# EAGLE design MODULO_BUZZER (EAGLE 7.5.0)
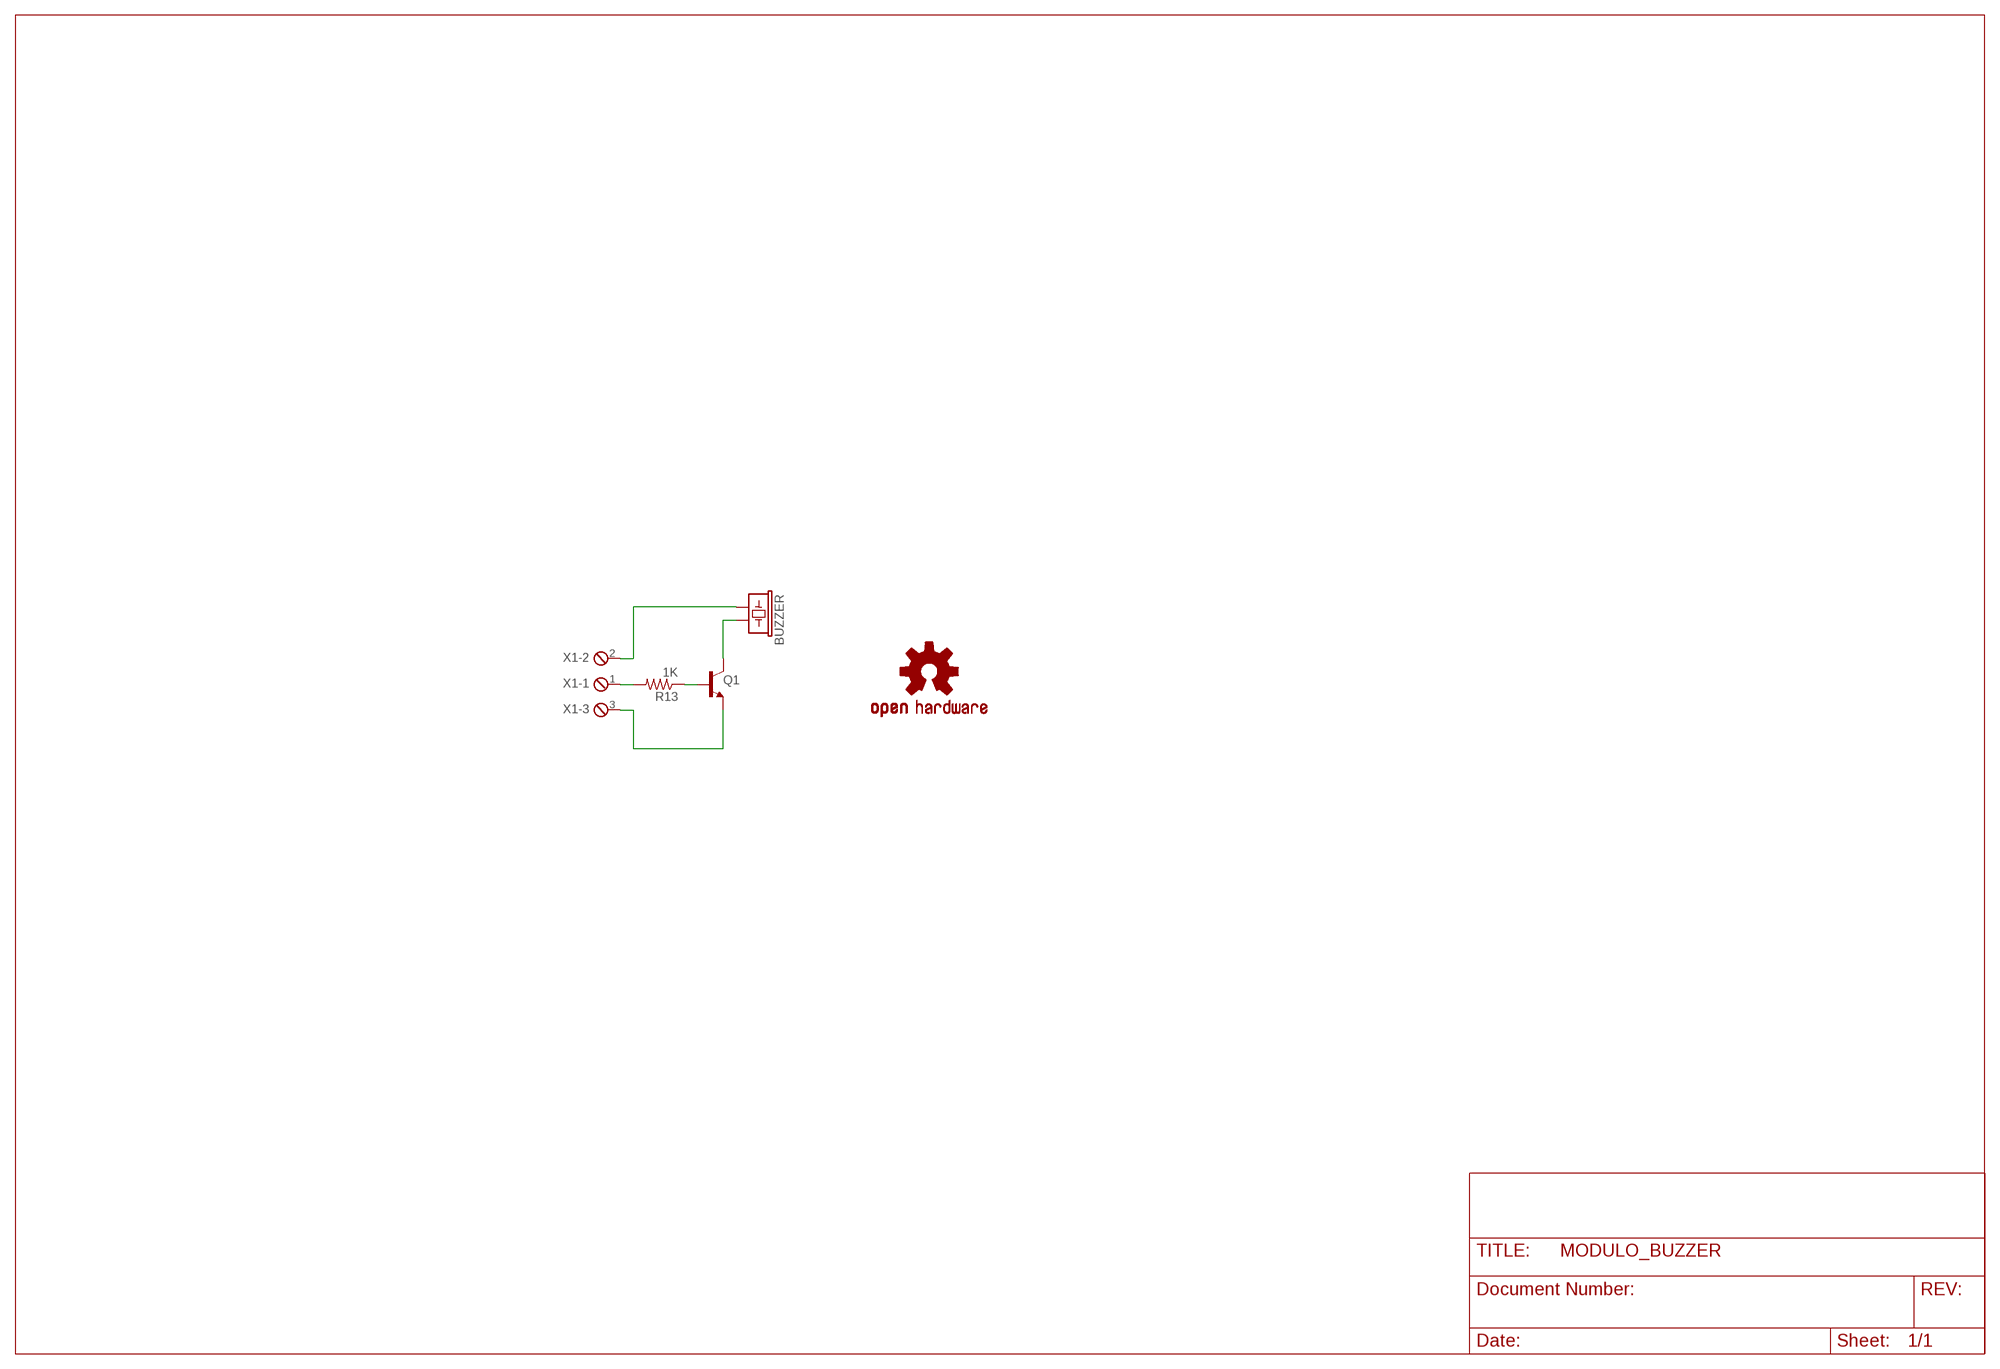
[diagram p0: schematic, sheet 1]

## Parts
BUZZER  BUZZERNS  [BUZZER-12MM-NS]
LOGO1  OSHW-LOGOM  [OSHW-LOGO-M]
Q1  BC548  [TO92-EBC]
R13  1K  RESISTORPTH-1/4W  [AXIAL-0.4]
X1  MPT3  [3POL254]

## Nets
N$27: Q1.B R13.P$1
N$28: BUZZER.+ X1.2
N$29: BUZZER.- Q1.C
N$30: Q1.E X1.3
N$32: R13.P$2 X1.1

## Library data of the parts
BUZZER = SparkFun:BUZZER: Buzzer 12mm Spark Fun Electronics SKU : Comp-Buzzer
LOGO1 = SparkFun-Aesthetics:OSHW-LOGO: Open Source Hardware Logo This logo indicates the piece of hardware it is found on incorporates a OSHW license and/or adheres to the definition of open source hardware found here: http://freedomdefined.org/OSHW
Q1 = transistor-npn:BC548*: NPN Transistor
R13 = SparkFun:RESISTOR: Resistor Basic schematic elements and footprints for 0603, 1206, and PTH resistors.
X1 = con-phoenix-254:MPT3: PHOENIX CONNECTOR; OC_FARNELL: unknown; OC_NEWARK: unknown

## Board
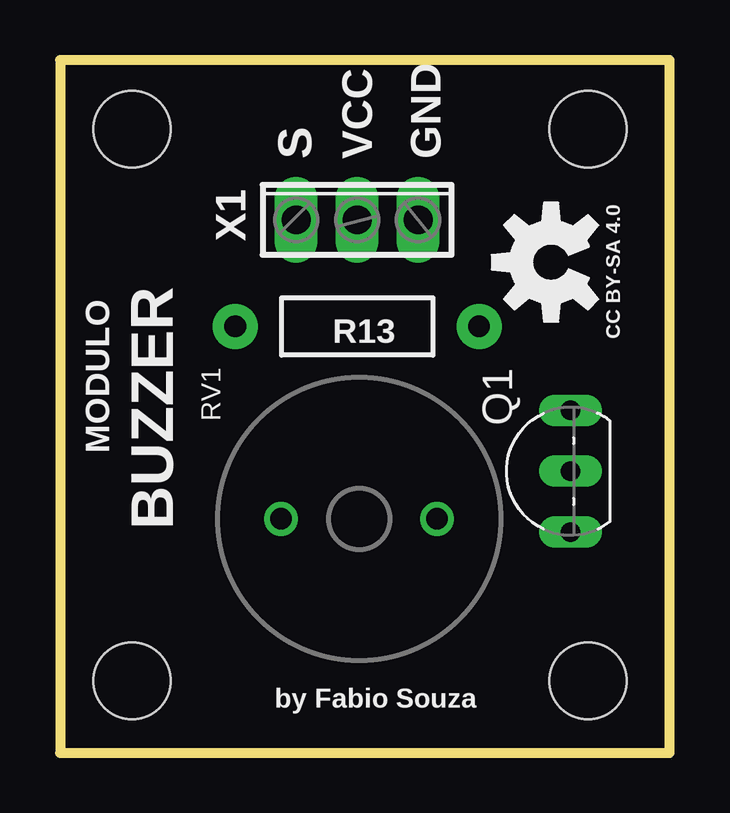
[diagram p1: board, top side]
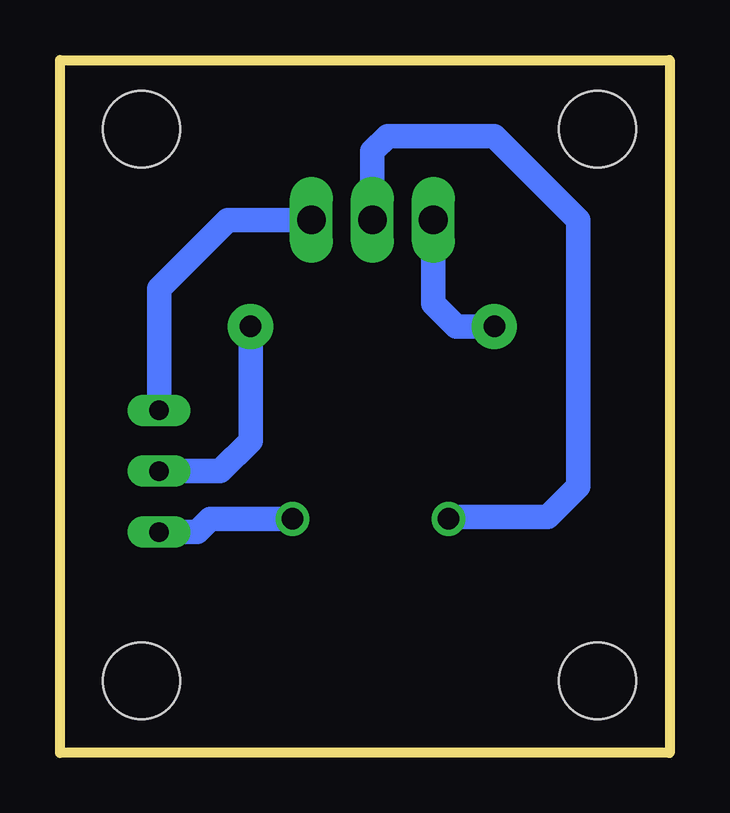
[diagram p2: board, bottom side, seen from below]

Size 25.4 x 28.89 mm. Coordinates in mm from the lower left corner, seen from the top.
Outline: 0,0 25.4,0 25.4,28.89 0,28.89 0,0
Copper layers (1*16): Top 0.035mm / dielectric 1.5mm / Bottom 0.035mm
Design rules "default": minimum track width 10mil, minimum drill 24mil, track to track 8mil, track to pad 8mil, pad to pad 8mil, via to via 8mil, smd to smd 8mil, copper to edge 40mil, drill to drill 8mil, minimum pad ring 10mil, minimum via ring 8mil, stop-mask expansion 4mil, vias tented up to drill 0mil, thermal gap 10mil
Holes 3.2 mm at 22,3.01 3,3.01 3,26.01 22,26.01

### Footprints (pad centres in the part's own frame; a part is rotated, then mirrored left to right if it is on the bottom)
BUZZER-12MM-NS = drill 0.9: + 3.25,0; - -3.25,0
TO92-EBC = drill 0.813 long: B 0,-1.27; C -2.54,-1.27; E 2.54,-1.27
AXIAL-0.4 = drill 0.9 pad 1.88: P$1 -5.08,0; P$2 5.08,0
3POL254 = drill 1.2 long: 1 -2.54,0; 2 0,0; 3 2.54,0

### Placement (x,y rotation side)
BUZZER  12.46,9.76 180 top
LOGO1  20.46,20.46 90 top
Q1  20,11.75 90 top
R13  12.38,17.78 180 top
X1  12.38,22.23 0 top

### Tracks (layer width: path | path; a pad name or v marks a point on that pad's centre or on a via)
N$27
  Bottom 1.016: R13.P$1 17.46,13.02 18.73,11.75 Q1.B
N$28
  Bottom 1.016: BUZZER.+ 9.13,9.84 5.08,9.84 3.81,11.11 3.81,22.23 7.3,25.72 11.75,25.72 12.38,25.08 X1.2
N$29
  Bottom 1.016: BUZZER.- 19.13,9.76 19.68,9.21 Q1.C
N$30
  Bottom 1.016: Q1.E 21.27,19.37 18.41,22.23 X1.3
N$32
  Bottom 1.016: R13.P$2 8.89,17.78 9.84,18.73 X1.1

### Text on the board
tPlace: S | VCC | GND | CC BY-SA 4.0 | RV1 | MODULO | by Fabio Souza